# EAGLE design Breakouts3 (EAGLE 9.6.2)
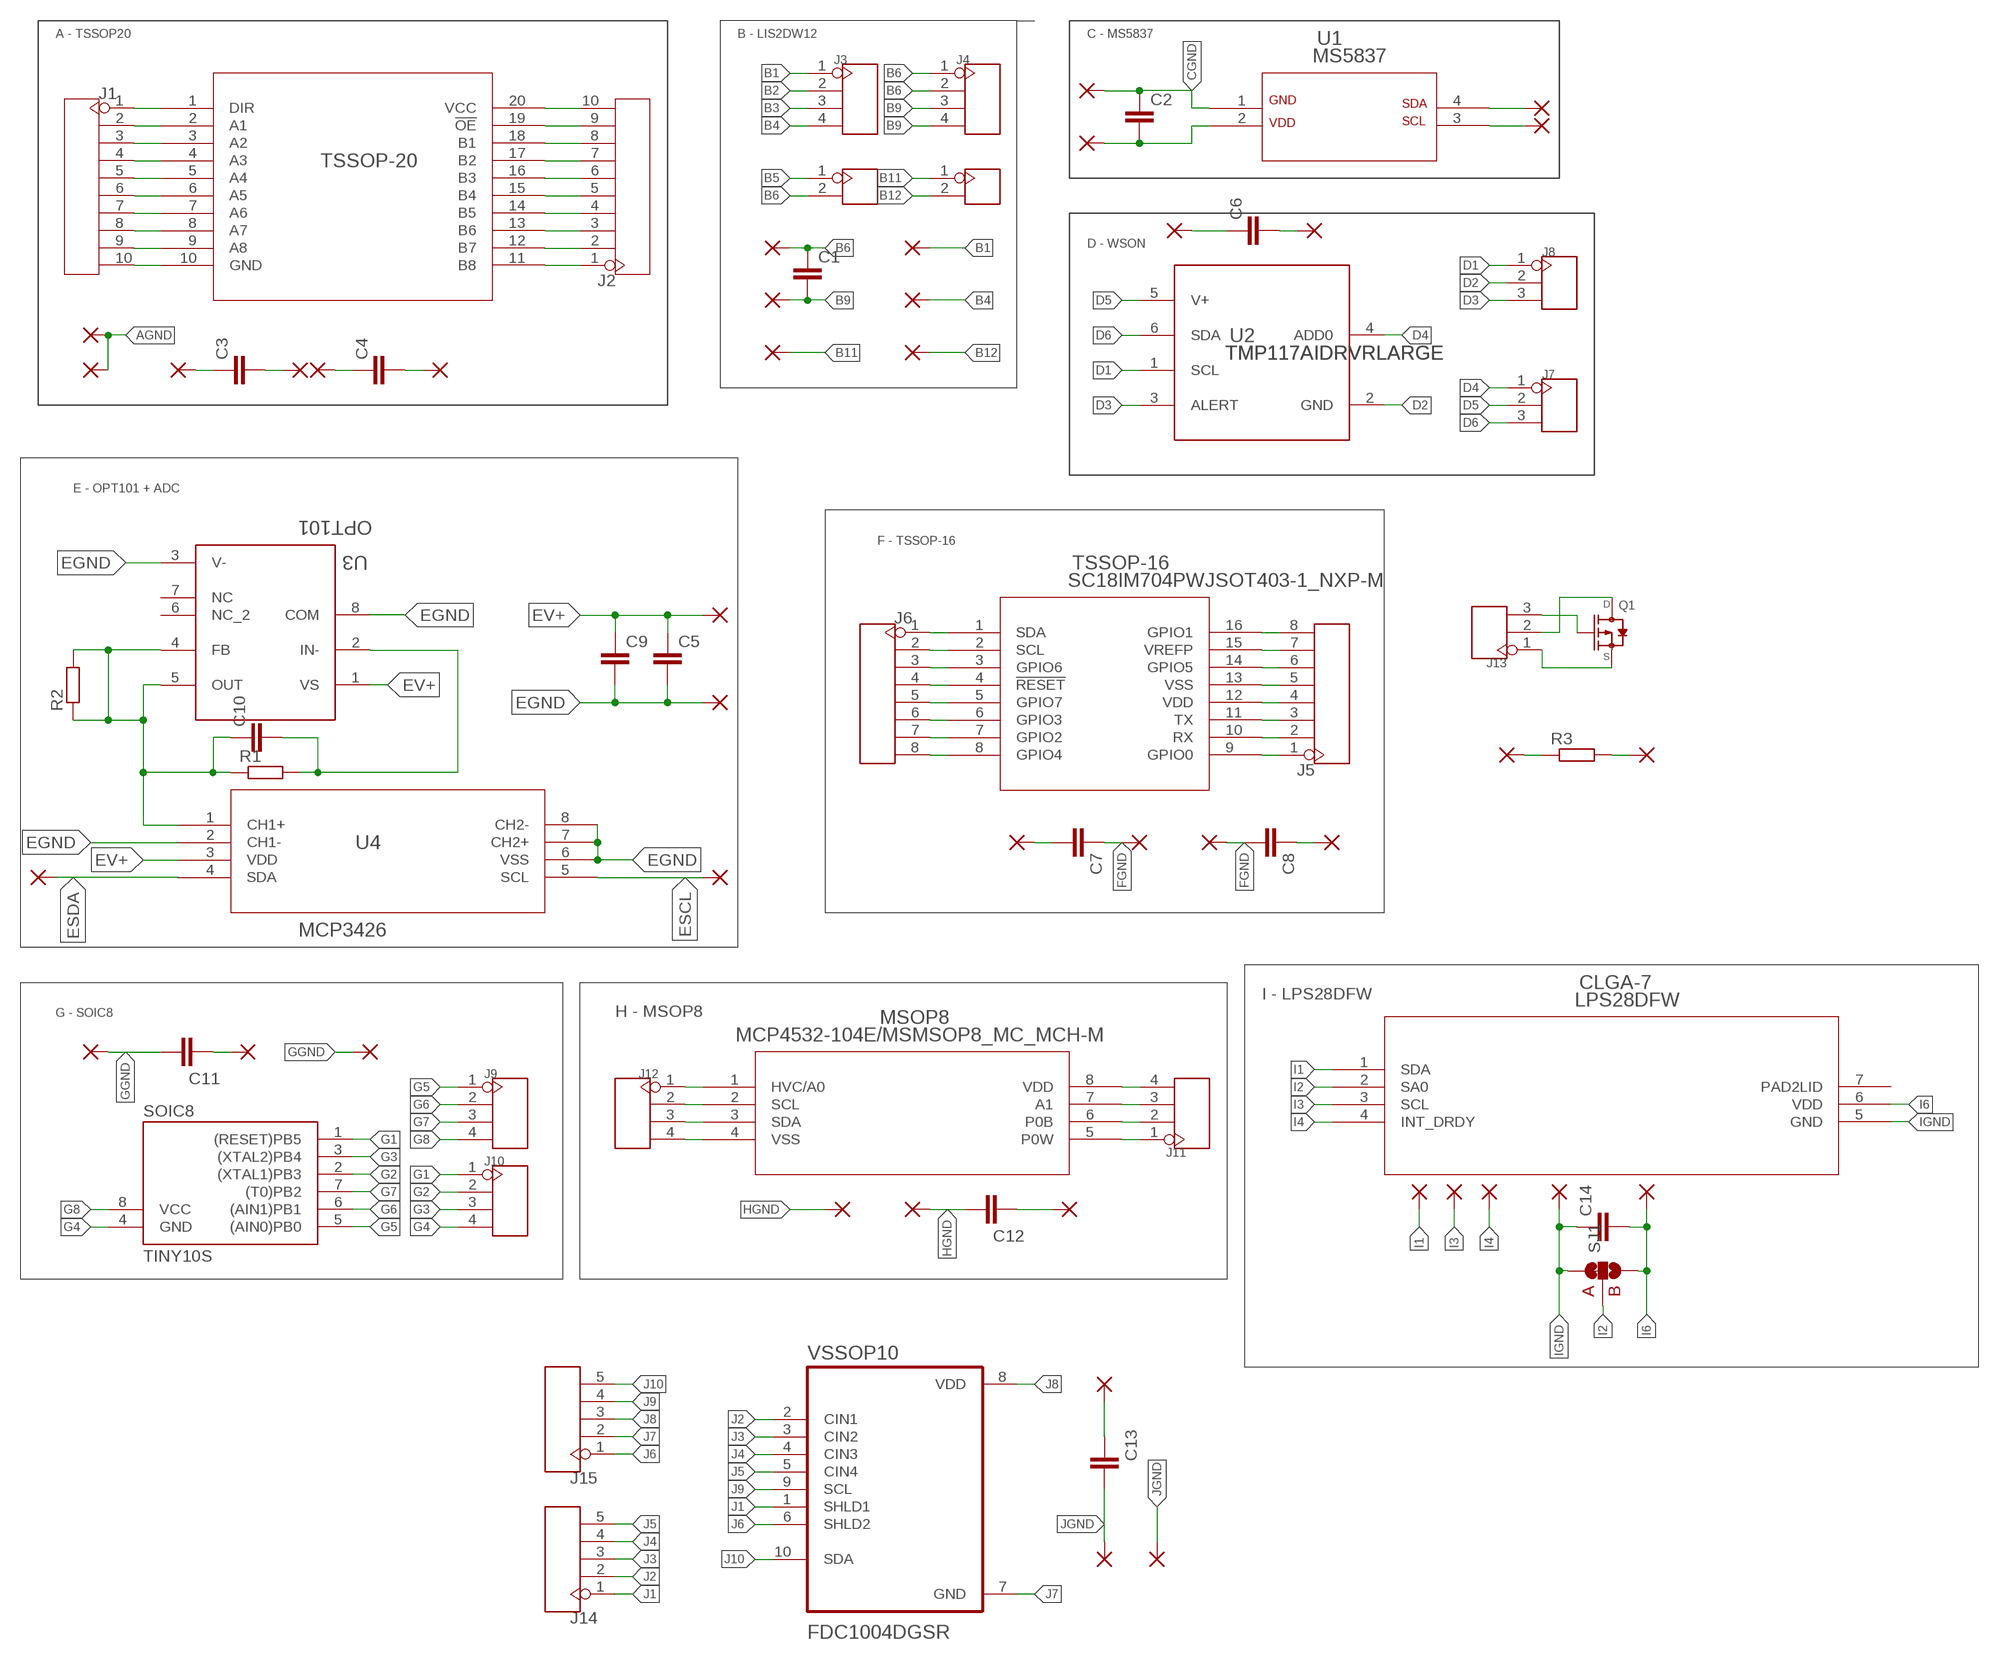
[diagram p0: schematic, sheet 1]

## Parts
C1  C-EU1206  [1206]
C2  C-EU1206  [1206]
C3  C-EU1206  [1206]
C4  C-EU1206  [1206]
C5  C-EU1206  [1206]
C6  C-EU1206  [1206]
C7  C-EU1206  [1206]
C8  C-EU1206  [1206]
C9  C-EU1206  [1206]
C10  C-EU1206  [1206]
C11  C-EU1206  [1206]
C12  C-EU1206  [1206]
C13  C-EU1206  [1206]
C14  C-EU1206  [1206]
CLGA-7  LPS28DFW  LPS28DFWTRLARGE  [CCLGA7_LPS28DFW_LARGE]
J1  HEADER-10P-2.54  [10P-2.54]
J2  HEADER-10P-2.54  [10P-2.54]
J3  HEADER-4P-SMD-1.27  [4P-1.27-SMD]
J4  HEADER-4P-SMD-1.27  [4P-1.27-SMD]
J5  HEADER-8P-2.54  [8P-2.54]
J6  HEADER-8P-2.54  [8P-2.54]
J7  HEADER-3P-2.54  [3P-2.54]
J8  HEADER-3P-2.54  [3P-2.54]
J9  HEADER-4P-60/35MIL  [4P-65/35MIL]
J10  HEADER-4P-60/35MIL  [4P-65/35MIL]
J11  HEADER-4P-60/35MIL  [4P-65/35MIL]
J12  HEADER-4P-60/35MIL  [4P-65/35MIL]
J13  HEADER-3P-2.54  [3P-2.54]
J14  HEADER-5P-2.54  [5P-2.54]
J15  HEADER-5P-2.54  [5P-2.54]
MSOP8  MCP4532-104E/MSMSOP8_MC_MCH-M  [MSOP8_MC_MCH-M]
PAD1  WIREPADSMD1,27-254  [SMD1,27-2,54]
PAD2  WIREPADSMD1,27-254  [SMD1,27-2,54]
PAD3  WIREPADSMD1,27-254  [SMD1,27-2,54]
PAD4  WIREPADSMD1,27-254  [SMD1,27-2,54]
PAD5  WIREPADSMD1,27-254  [SMD1,27-2,54]
PAD6  WIREPADSMD1,27-254  [SMD1,27-2,54]
PAD7  WIREPADSMD1,27-254  [SMD1,27-2,54]
PAD8  WIREPADSMD1,27-254  [SMD1,27-2,54]
PAD9  WIREPADSMD1,27-254  [SMD1,27-2,54]
PAD10  WIREPADSMD1,27-254  [SMD1,27-2,54]
PAD11  WIREPADSMD1,27-254  [SMD1,27-2,54]
PAD12  WIREPADSMD1,27-254  [SMD1,27-2,54]
PAD13  WIREPADSMD1,27-254  [SMD1,27-2,54]
PAD14  WIREPADSMD1,27-254  [SMD1,27-2,54]
PAD15  WIREPADSMD1,27-254  [SMD1,27-2,54]
PAD16  WIREPADSMD1,27-254  [SMD1,27-2,54]
PAD17  WIREPADSMD1,27-254  [SMD1,27-2,54]
PAD18  WIREPADSMD1,27-254  [SMD1,27-2,54]
PAD19  WIREPADSMD1,27-254  [SMD1,27-2,54]
PAD20  WIREPADSMD1,27-254  [SMD1,27-2,54]
PAD21  WIREPADSMD1,27-254  [SMD1,27-2,54]
PAD22  WIREPADSMD1,27-254  [SMD1,27-2,54]
PAD23  WIREPADSMD1,27-254  [SMD1,27-2,54]
PAD24  WIREPADSMD1,27-254  [SMD1,27-2,54]
PAD25  WIREPADSMD1,27-254  [SMD1,27-2,54]
PAD26  WIREPADSMD1,27-254  [SMD1,27-2,54]
PAD27  WIREPADSMD1,27-254  [SMD1,27-2,54]
PAD28  WIREPADSMD1,27-254  [SMD1,27-2,54]
PAD29  WIREPADSMD1,27-254  [SMD1,27-2,54]
PAD30  WIREPADSMD1,27-254  [SMD1,27-2,54]
PAD31  WIREPADSMD1,27-254  [SMD1,27-2,54]
PAD32  WIREPADSMD1,27-254  [SMD1,27-2,54]
PAD33  WIREPADSMD1,27-254  [SMD1,27-2,54]
PAD34  WIREPADSMD1,27-254  [SMD1,27-2,54]
PAD35  WIREPADSMD1,27-254  [SMD1,27-2,54]
PAD36  WIREPADSMD1,27-254  [SMD1,27-2,54]
PAD37  WIREPADSMD1,27-254  [SMD1,27-2,54]
PAD38  WIREPADSMD1,27-254  [SMD1,27-2,54]
PAD39  WIREPADSMD1,27-254  [SMD1,27-2,54]
PAD40  WIREPADSMD1,27-254  [SMD1,27-2,54]
PAD41  WIREPADSMD1,27-254  [SMD1,27-2,54]
PAD42  WIREPADSMD1,27-254  [SMD1,27-2,54]
Q1  FDN338P_PMOSSOT23_LONG  [SOT23_LONG]
R1  R-EU_  [1206]
R2  R-EU_  [1206]
R3  R-EU_  [1206]
SJ1  SOLDERJUMPER_2WAYT  [SJ_2]
SOIC8  TINY10S  [SOIC8]
TSSOP-16  SC18IM704PWJSOT403-1_NXP-M  [SOT403-1_NXP-M]
TSSOP-20  SN74ACT245PWRPW20-M  [PW20-M]
U1  MS5837  MS583702BA01-50LARGE  [MS5837-02BA01_LARGE]
U2  TMP117AIDRVRLARGE  [DRV0006B-LARGE]
U3  OPT101  OPT101P-JLARGE  [DTL0008A_LARGE]
U4  MCP3426  MCP3426A0T-E/SN  [SOIC8-N_MC_MCH]
U$1  HEADER-2P  [2P-1.27-SMD]
U$2  HEADER-2P  [2P-1.27-SMD]
VSSOP10  FDC1004DGSR  [SOP50P490X110-10N]

## Nets
AGND: PAD15.1(P) PAD16.1(P)
B1: J3.1 PAD3.1(P)
B2: J3.2
B3: J3.3
B4: J3.4 PAD6.1(P)
B5: U$1.1
B6: C1.1 J4.1 J4.2 PAD1.1(P) U$1.2
B9: C1.2 J4.3 J4.4 PAD2.1(P)
B11: PAD4.1(P) U$2.1
B12: PAD5.1(P) U$2.2
CGND: C2.1 PAD7.1(P) U1.1(GND)
D1: J8.1 U2.1(SCL)
D2: J8.2 U2.2(GND)
D3: J8.3 U2.3(ALERT)
D4: J7.1 U2.4(ADD0)
D5: J7.2 U2.5(V+)
D6: J7.3 U2.6(SDA)
EGND: C5.2 C9.2 PAD24.1(P) U3.3(V-) U3.8(COM) U4.2(CH1-) U4.6(VSS) U4.7(CH2+) U4.8(CH2-)
ESCL: PAD25.1(P) U4.5(SCL)
ESDA: PAD26.1(P) U4.4(SDA)
EV+: C5.1 C9.1 PAD23.1(P) U3.1(VS) U4.3(VDD)
FGND: C7.1 C8.2 PAD20.1(P) PAD21.1(P)
G1: J10.1 SOIC8.1((RESET)PB5)
G2: J10.2 SOIC8.2((XTAL1)PB3)
G3: J10.3 SOIC8.3((XTAL2)PB4)
G4: J10.4 SOIC8.4(GND)
G5: J9.1 SOIC8.5((AIN0)PB0)
G6: J9.2 SOIC8.6((AIN1)PB1)
G7: J9.3 SOIC8.7((T0)PB2)
G8: J9.4 SOIC8.8(VCC)
GGND: C11.1 PAD27.1(P) PAD29.1(P)
HGND: C12.1 PAD31.1(P) PAD32.1(P)
I1: CLGA-7.1(SDA) PAD34.1(P)
I2: CLGA-7.2(SA0) SJ1.2
I3: CLGA-7.3(SCL) PAD35.1(P)
I4: CLGA-7.4(INT_DRDY) PAD36.1(P)
I6: C14.2 CLGA-7.6(VDD) PAD38.1(P) SJ1.3
IGND: C14.1 CLGA-7.5(GND) PAD37.1(P) SJ1.1
J1: J14.1 VSSOP10.1(SHLD1)
J2: J14.2 VSSOP10.2(CIN1)
J3: J14.3 VSSOP10.3(CIN2)
J4: J14.4 VSSOP10.4(CIN3)
J5: J14.5 VSSOP10.5(CIN4)
J6: J15.1 VSSOP10.6(SHLD2)
J7: J15.2 VSSOP10.7(GND)
J8: J15.3 VSSOP10.8(VDD)
J9: J15.4 VSSOP10.9(SCL)
J10: J15.5 VSSOP10.10(SDA)
JGND: C13.1 PAD41.1(P) PAD42.1(P)
N$1: J1.1 TSSOP-20.1(DIR)
N$2: C2.2 PAD8.1(P) U1.2(VDD)
N$3: PAD9.1(P) U1.4(SDA)
N$4: PAD10.1(P) U1.3(SCL)
N$5: J1.2 TSSOP-20.2(A1)
N$6: J1.3 TSSOP-20.3(A2)
N$7: J1.4 TSSOP-20.4(A3)
N$8: J1.5 TSSOP-20.5(A4)
N$9: J1.6 TSSOP-20.6(A5)
N$10: J1.7 TSSOP-20.7(A6)
N$11: J1.8 TSSOP-20.8(A7)
N$12: J1.9 TSSOP-20.9(A8)
N$13: J1.10 TSSOP-20.10(GND)
N$14: J2.10 TSSOP-20.20(VCC)
N$15: J2.9 TSSOP-20.19(!OE)
N$16: J2.8 TSSOP-20.18(B1)
N$17: J2.7 TSSOP-20.17(B2)
N$18: J2.6 TSSOP-20.16(B3)
N$19: J2.5 TSSOP-20.15(B4)
N$20: J2.4 TSSOP-20.14(B5)
N$21: J2.3 TSSOP-20.13(B6)
N$22: J2.2 TSSOP-20.12(B7)
N$23: J2.1 TSSOP-20.11(B8)
N$24: C3.1 PAD11.1(P)
N$25: C3.2 PAD13.1(P)
N$26: C4.1 PAD12.1(P)
N$27: C4.2 PAD14.1(P)
N$28: C6.1 PAD17.1(P)
N$29: C6.2 PAD18.1(P)
N$30: C7.2 PAD22.1(P)
N$31: PAD33.1(P) R3.1
N$32: C10.1 R1.1 R2.1 R2.2 U3.4(FB) U3.5(OUT) U4.1(CH1+)
N$33: C8.1 PAD19.1(P)
N$34: J6.1 TSSOP-16.1(SDA)
N$35: J6.2 TSSOP-16.2(SCL)
N$36: J6.3 TSSOP-16.3(GPIO6)
N$37: J6.4 TSSOP-16.4(!RESET)
N$38: J6.5 TSSOP-16.5(GPIO7)
N$39: J6.6 TSSOP-16.6(GPIO3)
N$40: J6.7 TSSOP-16.7(GPIO2)
N$41: J6.8 TSSOP-16.8(GPIO4)
N$42: J5.8 TSSOP-16.16(GPIO1)
N$43: J5.7 TSSOP-16.15(VREFP)
N$44: J5.6 TSSOP-16.14(GPIO5)
N$45: J5.5 TSSOP-16.13(VSS)
N$46: J5.4 TSSOP-16.12(VDD)
N$47: J5.3 TSSOP-16.11(TX)
N$48: J5.2 TSSOP-16.10(RX)
N$49: J5.1 TSSOP-16.9(GPIO0)
N$50: C10.2 R1.2 U3.2(IN-)
N$51: C11.2 PAD28.1(P)
N$52: J12.1 MSOP8.1(HVC/A0)
N$53: J12.2 MSOP8.2(SCL)
N$54: J12.3 MSOP8.3(SDA)
N$55: J12.4 MSOP8.4(VSS)
N$56: J11.4 MSOP8.8(VDD)
N$57: J11.3 MSOP8.7(A1)
N$58: J11.2 MSOP8.6(P0B)
N$59: J11.1 MSOP8.5(P0W)
N$60: PAD39.1(P) R3.2
N$61: C12.2 PAD30.1(P)
N$62: J13.3 Q1.1(G)
N$63: J13.2 Q1.3(D)
N$64: J13.1 Q1.2(S)
N$66: C13.2 PAD40.1(P)
Unconnected: CLGA-7.7(PAD2LID) U3.6(NC_2) U3.7(NC)

## Notes on the sheet
- A - TSSOP20 | B - LIS2DW12 | C - MS5837
- D - WSON
- E - OPT101 + ADC
- F - TSSOP-16
- I - LPS28DFW
- G - SOIC8 | H - MSOP8

## Library data of the parts
C1-C14 = Master 2016:C-EU: CAPACITOR, European symbol
CLGA-7 = SMD Breakouts:LPS28DFWTR
J1 J2 = Connector:HEADER-10P
J3 J4 = SMD Breakouts:HEADER-4P
J5 J6 = Connector:HEADER-8P
J7 J8 J13 = Connector:HEADER-3P
J9-J12 = Connector:HEADER-4P
J14 J15 = Connector:HEADER-5P
MSOP8 = SMD Breakouts:MCP4532-104E/MS; COPYRIGHT: Copyright (C) 2025 Ultra Librarian. All rights reserved.; MANUFACTURER_PART_NUMBER: MCP4532-104E/MS; MFR_NAME: Microchip
PAD1-PAD42 = Master 2016:WIREPAD: Wire PAD connect wire on PCB
Q1 = Master 2016:FDN338P_PMOS: Si2305DS Si2323CDS
R1-R3 = Master 2016:R-EU_: RESISTOR, European symbol
SJ1 = Master 2016:SOLDERJUMPER_2WAY: Solder Jumper 2 way solder jumper
SOIC8 = atmel:TINY10: MICROCONTROLLER 1 Kbytes ROM; OC_FARNELL: unknown; OC_NEWARK: unknown
TSSOP-16 = SMD Breakouts:SC18IM704PWJ; COPYRIGHT: Copyright (C) 2025 Ultra Librarian. All rights reserved.; MANUFACTURER_PART_NUMBER: SC18IM704PWJ; MFR_NAME: NXP
TSSOP-20 = SMD Breakouts:SN74ACT245PWR; COPYRIGHT: Copyright (C) 2025 Ultra Librarian. All rights reserved.; MANUFACTURER_PART_NUMBER: SN74ACT245PWR; MFR_NAME: Texas Instruments
U1 = SMD Breakouts:MS583702BA01-50
U2 = SMD Breakouts:TMP117AIDRVR
U3 = ESP32 Projects:OPT101P-J
U4 = ESP32 Projects:MCP3426A0T-E/SN; COPYRIGHT: Copyright (C) 2025 Ultra Librarian. All rights reserved.; MANUFACTURER_PART_NUMBER: MCP3426A0T-E/SN; MFR_NAME: Microchip
U$1 U$2 = SMD Breakouts:HEADER-2P
VSSOP10 = ESP32 Projects:FDC1004DGSR

## Board
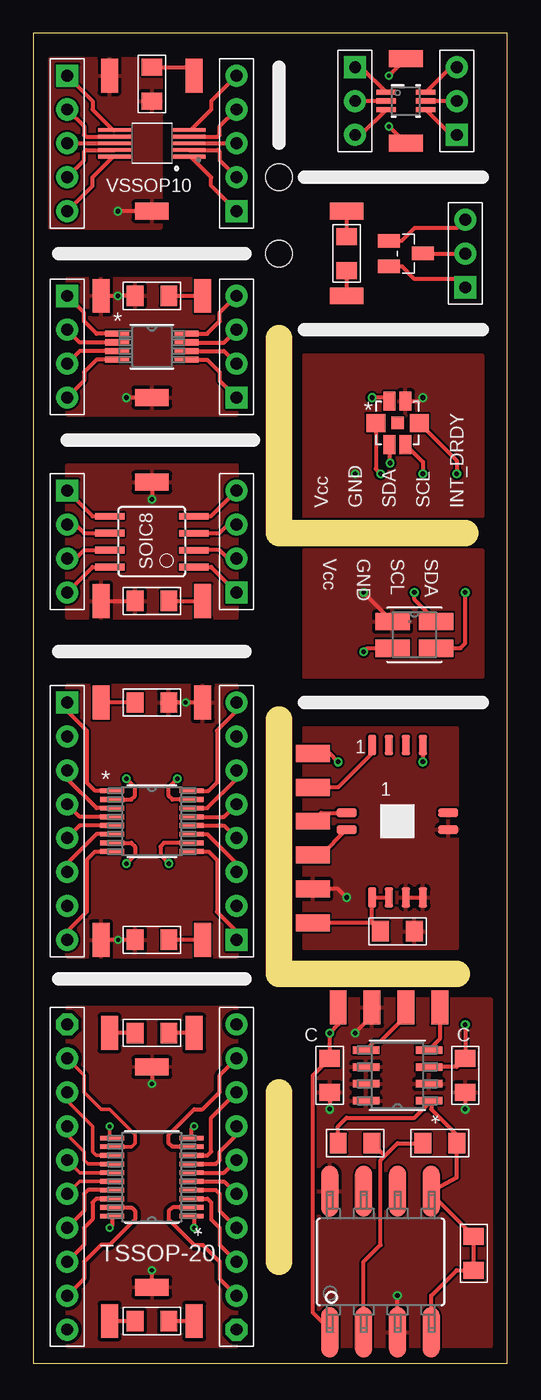
[diagram p1: board, top side]
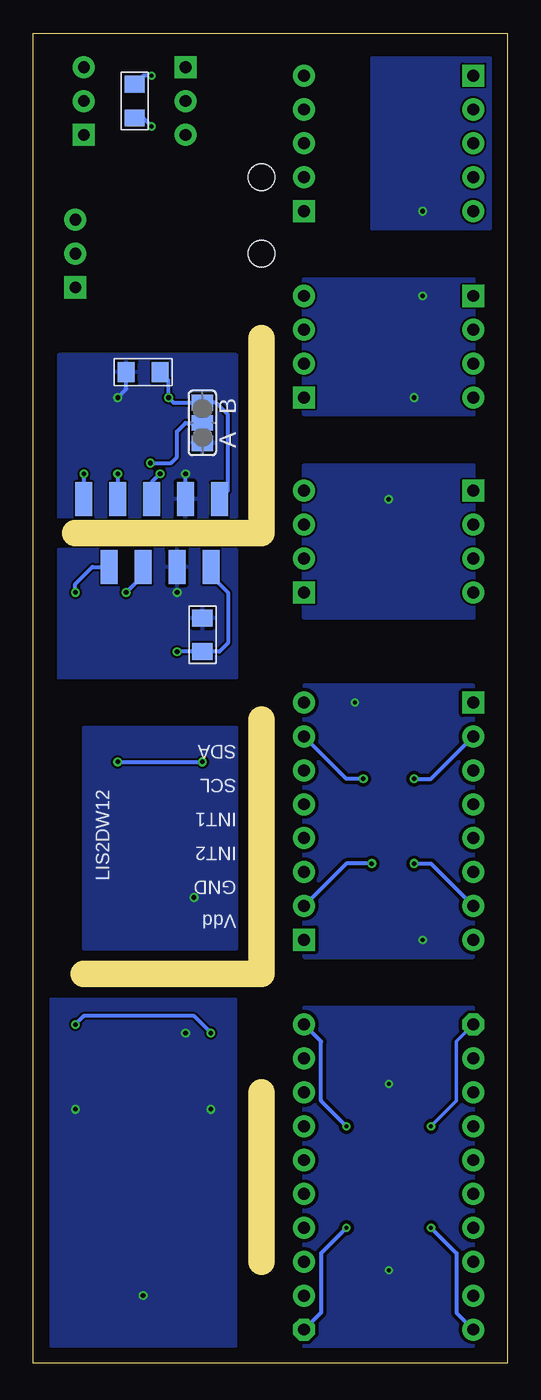
[diagram p2: board, bottom side, seen from below]

Size 35.54 x 99.69 mm. Coordinates in mm from the lower left corner, seen from the top.
Outline: 0,0 35.54,0 35.54,99.69 0,99.69 0,0
Copper layers (1*16): Top 0.035mm / dielectric 1.5mm / Bottom 0.035mm
Design rules "Seeed Fusion_eagle_rule_v1.1": minimum track width 6mil, minimum drill 12mil, track to track 6mil, track to pad 6mil, pad to pad 6mil, via to via 6mil, smd to smd 0mil, copper to edge 10mil, drill to drill 10mil, minimum pad ring 10mil, minimum via ring 6mil, stop-mask expansion 2mil, vias tented up to drill 100mil, thermal gap 10mil
Holes 2 mm at 18.41,83.19 18.41,88.9
Milling: 5 lines

### Footprints (pad centres in the part's own frame; a part is rotated, then mirrored left to right if it is on the bottom)
1206 = smd 1.27 x 1.524: 1 -1.27,0; 2 1.27,0
CCLGA7_LPS28DFW_LARGE = smd 1.422 x 1.346: 1 -1.626,0; 4 1.626,0 | smd 0.889 x 1.422: 2 -0.6,-1.626; 3 0.6,-1.626; 5 0.6,1.626; 6 -0.6,1.626 | smd 0.94 x 0.94: 7 0,0
10P-2.54 = drill 0.889 pad 1.651 octagon: 1 0,11.43 | drill 0.889 pad 1.651: 2 0,8.89; 3 0,6.35; 4 0,3.81; 5 0,1.27; 6 0,-1.27; 7 0,-3.81; 8 0,-6.35; 9 0,-8.89; 10 0,-11.43
4P-1.27-SMD = smd 1.524 x 0.635: 1 0,1.905; 2 0,0.635; 3 0,-0.635; 4 0,-1.905
8P-2.54 = drill 0.889 pad 1.651 square: 1 0,8.89 | drill 0.889 pad 1.651: 2 0,6.35; 3 0,3.81; 4 0,1.27; 5 0,-1.27; 6 0,-3.81; 7 0,-6.35; 8 0,-8.89
3P-2.54 = drill 0.889 pad 1.651 square: 1 0,2.54 | drill 0.889 pad 1.651: 2 0,0; 3 0,-2.54
4P-65/35MIL = drill 0.889 pad 1.651 square: 1 0,3.81 | drill 0.889 pad 1.651: 2 0,1.27; 3 0,-1.27; 4 0,-3.81
5P-2.54 = drill 0.889 pad 1.651 square: 1 0,5.08 | drill 0.889 pad 1.651: 2 0,2.54; 3 0,0; 4 0,-2.54; 5 0,-5.08
MSOP8_MC_MCH-M = smd 1.829 x 0.457: 1 -2.603,0.975; 2 -2.603,0.325; 3 -2.603,-0.325; 4 -2.603,-0.975; 5 2.603,-0.975; 6 2.603,-0.325; 7 2.603,0.325; 8 2.603,0.975
SMD1,27-2,54 = smd 1.27 x 2.54: 1 0,0
SOT23_LONG = smd 1.016 x 1.651: 1 -0.95,-1.27; 2 0.95,-1.27; 3 0,1.27
SJ_2 = smd 1.168 x 1.6: 1 -1.524,0; 2 0,0; 3 1.524,0
SOIC8 = smd 0.5 x 2.2: 1 -1.905,-3.154; 2 -0.645,-3.154; 3 0.625,-3.154; 4 1.895,-3.154; 5 1.905,3.154; 6 0.635,3.154; 7 -0.635,3.154; 8 -1.905,3.154
SOT403-1_NXP-M = smd 1.778 x 0.356: 1 -2.972,2.275; 2 -2.972,1.625; 3 -2.972,0.975; 4 -2.972,0.325; 5 -2.972,-0.325; 6 -2.972,-0.975; 7 -2.972,-1.625; 8 -2.972,-2.275; 9 2.972,-2.275; 10 2.972,-1.625; 11 2.972,-0.975; 12 2.972,-0.325; 13 2.972,0.325; 14 2.972,0.975; 15 2.972,1.625; 16 2.972,2.275
PW20-M = smd 1.778 x 0.356: 1 -2.972,2.925; 2 -2.972,2.275; 3 -2.972,1.625; 4 -2.972,0.975; 5 -2.972,0.325; 6 -2.972,-0.325; 7 -2.972,-0.975; 8 -2.972,-1.625; 9 -2.972,-2.275; 10 -2.972,-2.925; 11 2.972,-2.925; 12 2.972,-2.275; 13 2.972,-1.625; 14 2.972,-0.975; 15 2.972,-0.325; 16 2.972,0.325; 17 2.972,0.975; 18 2.972,1.625; 19 2.972,2.275; 20 2.972,2.925
MS5837-02BA01_LARGE = smd 2.565 x 1.295: 1 -1.635,1; 2 -1.635,-1; 3 1.635,-1; 4 1.635,1
DRV0006B-LARGE = smd 1.466 x 0.381: 1 -1.483,0.65; 2 -1.483,0; 3 -1.483,-0.65; 4 1.483,-0.65; 5 1.483,0; 6 1.483,0.65
DTL0008A_LARGE = smd 3.81 x 1.27: 1 -5.283,3.81; 2 -5.283,1.27; 3 -5.283,-1.27; 4 -5.283,-3.81; 5 5.283,-3.81; 6 5.283,-1.27; 7 5.283,1.27; 8 5.283,3.81
SOIC8-N_MC_MCH = smd 1.981 x 0.559: 1 -2.362,1.905; 2 -2.362,0.635; 3 -2.362,-0.635; 4 -2.362,-1.905; 5 2.362,-1.905; 6 2.362,-0.635; 7 2.362,0.635; 8 2.362,1.905
2P-1.27-SMD = smd 1.524 x 0.635: 1 0,0.635; 2 0,-0.635
SOP50P490X110-10N = smd 2.54 x 0.28: 1 -2.794,1; 2 -2.794,0.5; 3 -2.794,0; 4 -2.794,-0.5; 5 -2.794,-1; 6 2.794,-1; 7 2.794,-0.5; 8 2.794,0; 9 2.794,0.5; 10 2.794,1

### Placement (x,y rotation side)
C1  27.3,32.38 180 top
C2  22.86,54.61 270 bottom
C3  8.89,24.77 0 top
C4  8.89,3.17 0 top
C5  32.38,21.59 270 top
C6  27.94,94.61 90 bottom
C7  8.89,31.75 0 top
C8  8.89,49.53 0 top
C9  22.23,21.59 270 top
C10  24.13,16.51 0 top
C11  8.89,57.15 0 top
C12  8.89,80.01 0 top
C13  8.89,95.89 90 top
C14  27.3,74.3 0 bottom
CLGA-7  27.3,70.48 0 top
J1  15.24,13.97 180 top
J2  2.54,13.97 0 top
J3  27.3,46.35 90 top
J4  27.3,34.92 270 top
J5  15.24,40.64 180 top
J6  2.54,40.64 0 top
J7  31.75,94.61 180 top
J8  24.13,94.61 0 top
J9  2.54,61.59 0 top
J10  15.24,61.59 180 top
J11  15.24,76.2 180 top
J12  2.54,76.2 0 top
J13  32.38,83.19 180 top
J14  15.24,91.44 180 top
J15  2.54,91.44 0 top
MSOP8  8.89,76.2 0 top
PAD1  20.95,35.56 90 top
PAD2  20.95,33.02 90 top
PAD3  20.95,43.18 90 top
PAD4  20.95,38.1 90 top
PAD5  20.95,40.64 90 top
PAD6  20.95,45.72 90 top
PAD7  24.77,59.69 180 bottom
PAD8  22.23,59.69 180 bottom
PAD9  27.3,59.69 180 bottom
PAD10  29.84,59.69 180 bottom
PAD11  5.71,24.77 0 top
PAD12  5.71,3.17 0 top
PAD13  12.06,24.77 0 top
PAD14  12.06,3.17 0 top
PAD15  8.89,5.71 90 top
PAD16  8.89,22.23 90 top
PAD17  27.94,91.44 90 top
PAD18  27.94,97.79 90 top
PAD19  5.08,49.53 180 top
PAD20  5.08,31.75 180 top
PAD21  12.7,49.53 180 top
PAD22  12.7,31.75 180 top
PAD23  22.86,26.67 0 top
PAD24  25.4,26.67 0 top
PAD25  27.94,26.67 0 top
PAD26  30.48,26.67 0 top
PAD27  5.08,57.15 180 top
PAD28  12.7,57.15 180 top
PAD29  8.89,66.04 90 top
PAD30  12.7,80.01 0 top
PAD31  5.08,80.01 0 top
PAD32  8.89,72.39 90 top
PAD33  23.5,80.01 90 top
PAD34  26.67,64.77 0 bottom
PAD35  29.21,64.77 0 bottom
PAD36  31.75,64.77 0 bottom
PAD37  24.13,64.77 0 bottom
PAD38  21.59,64.77 0 bottom
PAD39  23.5,86.36 90 top
PAD40  12.06,96.52 0 top
PAD41  5.71,96.52 0 top
PAD42  8.89,86.36 90 top
Q1  27.94,83.19 270 top
R1  30.48,16.51 180 top
R2  33.02,8.26 270 top
R3  23.5,83.19 90 top
SJ1  22.86,70.48 90 bottom
SOIC8  8.89,61.59 90 top
TSSOP-16  8.89,40.64 0 top
TSSOP-20  8.89,13.97 180 top
U1  28.57,54.61 0 top
U2  27.94,94.61 0 top
U3  26.04,7.62 90 top
U4  27.3,21.59 180 top
U$1  31.11,40.64 0 top
U$2  23.5,40.64 180 top
VSSOP10  8.89,91.44 180 top

### Tracks (layer width: path | path; a pad name or v marks a point on that pad's centre or on a via)
AGND  (via drill 0.3 pad 0.61)
  Top 0.305: PAD15.1 v8.89,6.99 | PAD16.1 v8.89,20.95
  pour Bottom (isolate 0.254): 2.54,26.67 15.24,26.67 15.24,1.27 2.54,1.27
  pour Top (isolate 0.254): 2.54,26.67 2.54,1.27 15.24,1.27 15.24,26.67
B1
  Top 0.305: J3.1 25.4,45.72 22.86,43.18 PAD3.1
B4  (via drill 0.35)
  Top 0.305: J3.4 v29.21,45.09 | v22.86,45.09 22.23,45.72 PAD6.1
  Bottom 0.305: v29.21,45.09 v22.86,45.09
B6  (via drill 0.35)
  Top 0.305: J4.2 J4.1 | v23.5,34.92 22.86,35.56 PAD1.1
  pour Bottom: 20.32,47.62 31.75,47.62 31.75,31.11 20.32,31.11
  pour Top: 20.32,47.62 31.75,47.62 31.75,31.11 20.32,31.11
B9
  Top 0.305: J4.3 J4.4 25.4,33.02 | 25.4,33.02 PAD2.1 | C1.2 25.4,33.02
B11
  Top 0.305: PAD4.1 21.59,38.1 U$2.1
B12
  Top 0.305: PAD5.1 21.59,41.27 U$2.2
CGND  (via drill 0.35)
  Top 0.305: v24.77,57.78 U1.1
  pour Bottom: 33.66,60.96 33.66,51.44 20.32,51.44 20.32,60.96
  pour Top: 33.66,60.96 33.66,51.44 20.32,51.44 20.32,60.96
D1
  Top 0.305: U2.1 24.57,97.16 J8.1
D2
  Top 0.305: U2.2 J8.2
D3
  Top 0.305: U2.3 24.57,92.08 J8.3
D4
  Top 0.305: U2.4 31.31,92.08 J7.1
D5
  Top 0.305: J7.2 U2.5
D6
  Top 0.305: U2.6 31.31,97.16 J7.3
EGND  (via drill 0.35)
  Top 0.305: C5.2 v32.38,19.05 | C9.2 v22.23,19.05 | PAD24.1 25.4,26.04 v24.13,24.77 | U3.3 v27.3,5.08
  pour Bottom: 20.32,27.3 34.29,27.3 34.29,1.27 20.32,1.27
  pour Top: 20.32,27.3 34.29,27.3 34.29,1.27 20.32,1.27
ESCL
  Top 0.305: U4.5 25.58,24.13 26.04,24.13 27.94,26.04 PAD25.1
ESDA
  Top 0.305: PAD26.1 30.48,24.31 U4.4
EV+  (via drill 0.35)
  Top 0.305: U4.3 31.75,22.23 C5.1 v32.38,25.4 | PAD23.1 22.86,25.4 v22.23,24.77 C9.1 20.95,21.59 20.95,3.81 21.84,2.92 U3.1
  Bottom 0.305: v22.23,24.77 23.5,26.04 31.75,26.04 v32.38,25.4
FGND  (via drill 0.3 pad 0.61)
  Top 0.305: C8.2 v11.43,49.53 PAD21.1 | PAD20.1 v6.35,31.75 C7.1
  pour Bottom (isolate 0.254): 2.54,50.8 15.24,50.8 15.24,30.48 2.54,30.48
  pour Top: 2.54,50.8 15.24,50.8 15.24,30.48 2.54,30.48
G1
  Top 0.305: SOIC8.1 13.34,59.69 J10.1
G2
  Top 0.305: J10.2 14.61,60.33 13.97,60.96 12.05,60.96 SOIC8.2
G3
  Top 0.305: SOIC8.3 13.96,62.22 14.61,62.87 J10.3
G4
  Top 0.305: SOIC8.4 13.32,63.49 J10.4
G5
  Top 0.305: J9.1 4.45,63.5 SOIC8.5
G6
  Top 0.305: J9.2 3.17,62.87 3.81,62.23 SOIC8.6
G7
  Top 0.305: J9.3 3.17,60.33 3.81,60.96 SOIC8.7
G8
  Top 0.305: J9.4 4.45,59.69 SOIC8.8
GGND  (via drill 0.35)
  Top 0.305: PAD29.1 v8.89,64.77 | PAD27.1 C11.1
  pour Bottom: 2.54,67.31 2.54,55.88 15.24,55.88 15.24,67.31
  pour Top: 2.54,67.31 15.24,67.31 15.24,55.88 2.54,55.88
HGND  (via drill 0.35)
  Top 0.305: PAD32.1 v6.99,72.39 | C12.1 v6.35,80.01 PAD31.1
  pour Top: 2.54,81.28 2.54,71.12 15.24,71.12 15.24,81.28
  pour Bottom: 2.54,81.28 2.54,71.12 15.24,71.12 15.24,81.28
I1  (via drill 0.35)
  Top 0.305: CLGA-7.1 25.68,67.03 v26.04,66.67
  Bottom 0.305: v26.04,66.67 26.67,66.04 PAD34.1
I2  (via drill 0.35)
  Top 0.305: CLGA-7.2 26.7,67.53 v26.76,67.48
  Bottom 0.305: v26.76,67.48 25.23,67.48 24.77,67.94 24.77,69.85 24.13,70.48 SJ1.2
I3  (via drill 0.35)
  Top 0.305: CLGA-7.3 29.21,67.56 v29.21,66.67
  Bottom 0.305: v29.21,66.67 PAD35.1
I4  (via drill 0.35)
  Top 0.305: CLGA-7.4 31.75,67.67 v31.75,66.67
  Bottom 0.305: v31.75,66.67 PAD36.1
I6  (via drill 0.35)
  Top 0.305: CLGA-7.6 26.43,72.39 v25.4,72.39
  Bottom 0.305: C14.2 25.4,73.66 v25.4,72.39 25.02,72.01 SJ1.3 21.84,72.01 20.95,71.12 20.95,65.41 PAD38.1
IGND  (via drill 0.35)
  Top 0.305: CLGA-7.5 28.93,72.11 v29.21,72.39
  Bottom 0.305: v29.21,72.39 28.57,73.03 C14.1 | PAD37.1 v24.13,66.67
  pour Bottom: 20.32,63.5 20.32,75.56 33.66,75.56 33.66,63.5
  pour Top: 20.32,75.56 33.66,75.56 33.66,63.5 20.32,63.5
J1
  Top 0.305: J14.1 13.34,88.27 13.34,88.9 11.79,90.44 VSSOP10.1
J2
  Top 0.305: VSSOP10.2 13.84,90.94 13.97,90.81 13.97,90.17 J14.2
J3
  Top 0.305: VSSOP10.3 J14.3
J4
  Top 0.305: VSSOP10.4 13.84,91.94 13.97,92.08 13.97,92.71 J14.4
J5
  Top 0.305: J14.5 13.34,94.61 13.34,93.98 11.79,92.44 VSSOP10.5
J6
  Top 0.305: J15.1 4.45,94.61 4.45,93.98 5.99,92.44 VSSOP10.6
J7
  Top 0.305: J15.2 3.81,92.71 3.81,92.08 3.94,91.94 VSSOP10.7
J8
  Top 0.305: J15.3 VSSOP10.8
J9
  Top 0.305: J15.4 3.81,90.17 3.81,90.81 3.94,90.94 VSSOP10.9
J10
  Top 0.305: J15.5 4.45,88.27 4.45,88.9 5.99,90.44 VSSOP10.10
JGND  (via drill 0.35)
  Top 0.305: PAD42.1 v6.35,86.36
  pour Bottom: 1.27,97.79 10.16,97.79 10.16,85.09 1.27,85.09
  pour Top: 1.27,97.79 9.53,97.79 9.53,85.09 1.27,85.09
N$1  (via drill 0.3 pad 0.61)
  Top 0.305: TSSOP-20.1 12.06,10.84 v12.06,10.16
  Bottom 0.305: v12.06,10.16 13.97,8.26 13.97,3.81 J1.1
N$2  (via drill 0.35)
  Top 0.305: v24.77,53.34 25.04,53.61 U1.2
  Bottom 0.305: PAD8.1 22.23,59.05 20.95,57.78 20.95,53.98 21.59,53.34 C2.2 v24.77,53.34
N$3  (via drill 0.35)
  Top 0.305: U1.4 28.57,57.24 v28.57,57.78
  Bottom 0.305: v28.57,57.78 27.3,59.05 PAD9.1
N$4  (via drill 0.35)
  Top 0.305: U1.3 32.02,53.61 32.38,53.98 v32.38,57.78
  Bottom 0.305: v32.38,57.78 32.38,58.42 31.11,59.69 PAD10.1
N$5
  Top 0.305: TSSOP-20.2 10.43,11.7 10.16,11.43 10.16,10.79 12.06,8.89 12.7,8.89 13.97,7.62 13.97,6.35 J1.2
N$6
  Top 0.305: TSSOP-20.3 13.05,12.35 13.34,12.06 13.34,10.79 13.97,10.16 13.97,8.89 J1.3
N$7
  Top 0.305: TSSOP-20.4 13.68,12.99 13.97,12.7 13.97,11.43 J1.4
N$8
  Top 0.305: TSSOP-20.5 14.29,13.64 J1.5
N$9
  Top 0.305: TSSOP-20.6 14.29,14.29 J1.6
N$10
  Top 0.305: TSSOP-20.7 13.68,14.95 13.97,15.24 13.97,15.88 15.24,17.14 J1.7
N$11
  Top 0.305: TSSOP-20.8 13.05,15.6 13.34,15.88 13.34,18.41 J1.8
N$12
  Top 0.305: TSSOP-20.9 10.43,16.25 10.16,16.51 10.16,17.14 12.06,19.05 12.7,19.05 13.97,20.32 13.97,21.59 J1.9
N$13  (via drill 0.3 pad 0.61)
  Top 0.305: TSSOP-20.10 11.86,17.58 v12.06,17.78
  Bottom 0.305: v12.06,17.78 13.97,19.68 13.97,24.13 J1.10
N$14  (via drill 0.3 pad 0.61)
  Top 0.305: TSSOP-20.20 5.92,10.36 v5.71,10.16
  Bottom 0.305: v5.71,10.16 3.81,8.26 3.81,3.81 J2.10
N$15
  Top 0.305: TSSOP-20.19 7.36,11.7 7.62,11.43 7.62,10.79 5.71,8.89 5.08,8.89 3.81,7.62 3.81,6.35 J2.9
N$16
  Top 0.305: TSSOP-20.18 4.72,12.35 4.45,12.06 4.45,10.79 3.81,10.16 3.81,8.89 J2.8
N$17
  Top 0.305: TSSOP-20.17 4.11,12.99 3.81,12.7 3.81,11.43 J2.7
N$18
  Top 0.254: TSSOP-20.16 3.48,13.64 J2.6
N$19
  Top 0.254: TSSOP-20.15 3.48,14.29 J2.5
N$20
  Top 0.254: TSSOP-20.14 4.11,14.95 3.81,15.24 3.81,15.88 2.54,17.14 J2.4
N$21
  Top 0.254: TSSOP-20.13 4.72,15.6 4.45,15.88 4.45,17.78 2.54,19.68 J2.3
N$22
  Top 0.254: TSSOP-20.12 7.36,16.25 7.62,16.51 7.62,17.14 5.71,19.05 5.08,19.05 3.81,20.32 3.81,21.59 J2.2
N$23  (via drill 0.3 pad 0.61)
  Top 0.254: TSSOP-20.11 5.71,17.1 v5.71,17.78
  Bottom 0.254: v5.71,17.78 3.81,19.68 3.81,24.13 J2.1
N$24
  Top 0.305: C3.1 PAD11.1
N$25
  Top 0.305: PAD13.1 C3.2
N$26
  Top 0.305: C4.1 PAD12.1
N$27
  Top 0.305: PAD14.1 C4.2
N$28  (via drill 0.3 pad 0.61)
  Top 0.305: PAD17.1 v26.67,92.71
  Bottom 0.305: v26.67,92.71 27.3,93.34 C6.1
N$29  (via drill 0.3 pad 0.61)
  Top 0.305: PAD18.1 v26.67,96.52
  Bottom 0.305: v26.67,96.52 27.3,96.52 C6.2
N$30
  Top 0.305: PAD22.1 C7.2
N$31
  Top 0.305: R3.1 PAD33.1
N$32
  Top 0.305: U3.4 29.84,5.08 31.75,6.99 R2.2 R2.1 30.23,12.32 U3.5 31.75,13.93 R1.1 31.75,17.14 29.84,19.05 29.84,19.51 U4.1 29.67,19.51 28.57,18.41 23.5,18.41 22.86,17.78 C10.1
N$33
  Top 0.305: C8.1 PAD19.1
N$34
  Top 0.305: J6.1 2.54,48.9 4.01,47.42 4.01,43.55 4.65,42.91 TSSOP-16.1
N$35  (via drill 0.35)
  Top 0.305: TSSOP-16.2 7.34,42.27 7.62,42.55 7.62,43.18 v6.99,43.81
  Bottom 0.305: v6.99,43.81 5.71,43.81 J6.2
N$36
  Top 0.254: J6.3 2.54,43.81
  Top 0.305: TSSOP-16.3 4.74,41.62 2.54,43.81
N$37
  Top 0.305: TSSOP-16.4 3.48,40.97 J6.4
N$38
  Top 0.305: TSSOP-16.5 3.48,40.31 J6.5
N$39
  Top 0.305: TSSOP-16.6 4.74,39.66 2.54,37.47 J6.6
N$40  (via drill 0.35)
  Top 0.305: TSSOP-16.7 7.34,39.02 7.62,38.73 7.62,38.1 v6.99,37.47
  Bottom 0.305: v6.99,37.47 5.71,37.47 J6.7
N$41
  Top 0.305: TSSOP-16.8 4.65,38.37 4.01,37.73 4.01,33.86 2.54,32.38 J6.8
N$42
  Top 0.305: J5.8 15.24,48.9 13.77,47.42 13.77,43.55 13.13,42.91 TSSOP-16.16
N$43  (via drill 0.35)
  Top 0.305: TSSOP-16.15 10.44,42.27 10.16,42.55 10.16,43.18 v10.79,43.81
  Bottom 0.305: v10.79,43.81 12.06,43.81 J5.7
N$44
  Top 0.305: TSSOP-16.14 13.04,41.62 15.24,43.81 J5.6
N$45
  Top 0.305: TSSOP-16.13 14.29,40.97 J5.5
N$46
  Top 0.305: TSSOP-16.12 14.29,40.31 J5.4
N$47
  Top 0.305: TSSOP-16.11 13.04,39.66 15.24,37.47 J5.3
N$48  (via drill 0.35)
  Top 0.305: TSSOP-16.10 9.8,39.02 9.53,38.73 9.53,38.1 v10.16,37.47
  Bottom 0.305: J5.2 12.06,37.47 v10.16,37.47
N$49
  Top 0.305: J5.1 15.24,32.38 13.77,33.86 13.77,37.73 13.13,38.37 TSSOP-16.9
N$50
  Top 0.305: U3.2 24.77,7.62 26.04,8.89 26.04,15.24 26.35,15.56 | 26.35,15.56 C10.2 | 26.35,15.56 27.3,16.51 R1.2
N$51
  Top 0.305: C11.2 PAD28.1
N$52
  Top 0.305: MSOP8.1 4.74,77.17 3.81,78.11 3.81,78.74 J12.1
N$53
  Top 0.305: MSOP8.2 3.48,76.53 J12.2
N$54
  Top 0.305: MSOP8.3 3.48,75.88 J12.3
N$55
  Top 0.305: MSOP8.4 4.74,75.22 3.81,74.3 3.81,73.66 J12.4
N$56
  Top 0.305: MSOP8.8 13.04,77.17 13.97,78.11 13.97,78.74 J11.4
N$57
  Top 0.305: MSOP8.7 14.29,76.53 J11.3
N$58
  Top 0.305: MSOP8.6 14.29,75.88 J11.2
N$59
  Top 0.305: MSOP8.5 13.04,75.22 13.97,74.3 13.97,73.66 J11.1
N$60
  Top 0.305: PAD39.1 R3.2
N$61
  Top 0.305: C12.2 PAD30.1
N$62
  Top 0.305: Q1.1 27.62,84.14 28.57,85.09 31.75,85.09 J13.3
N$63
  Top 0.305: Q1.3 J13.2
N$64
  Top 0.305: Q1.2 27.62,82.23 28.57,81.28 31.75,81.28 J13.1
N$66
  Top 0.305: C13.2 11.43,97.16 PAD40.1

### Text on the board
tPlace: Vcc | GND | SDA | SCL | INT_DRDY | Vcc | GND | SCL | SDA | 1 | 1 | C | C
bPlace: SDA | SCL | INT1 | INT2 | GND | LIS2DW12 | Vdd